# Altium project WR_Cute_Carrier.PrjPcb (part 1 of 2)
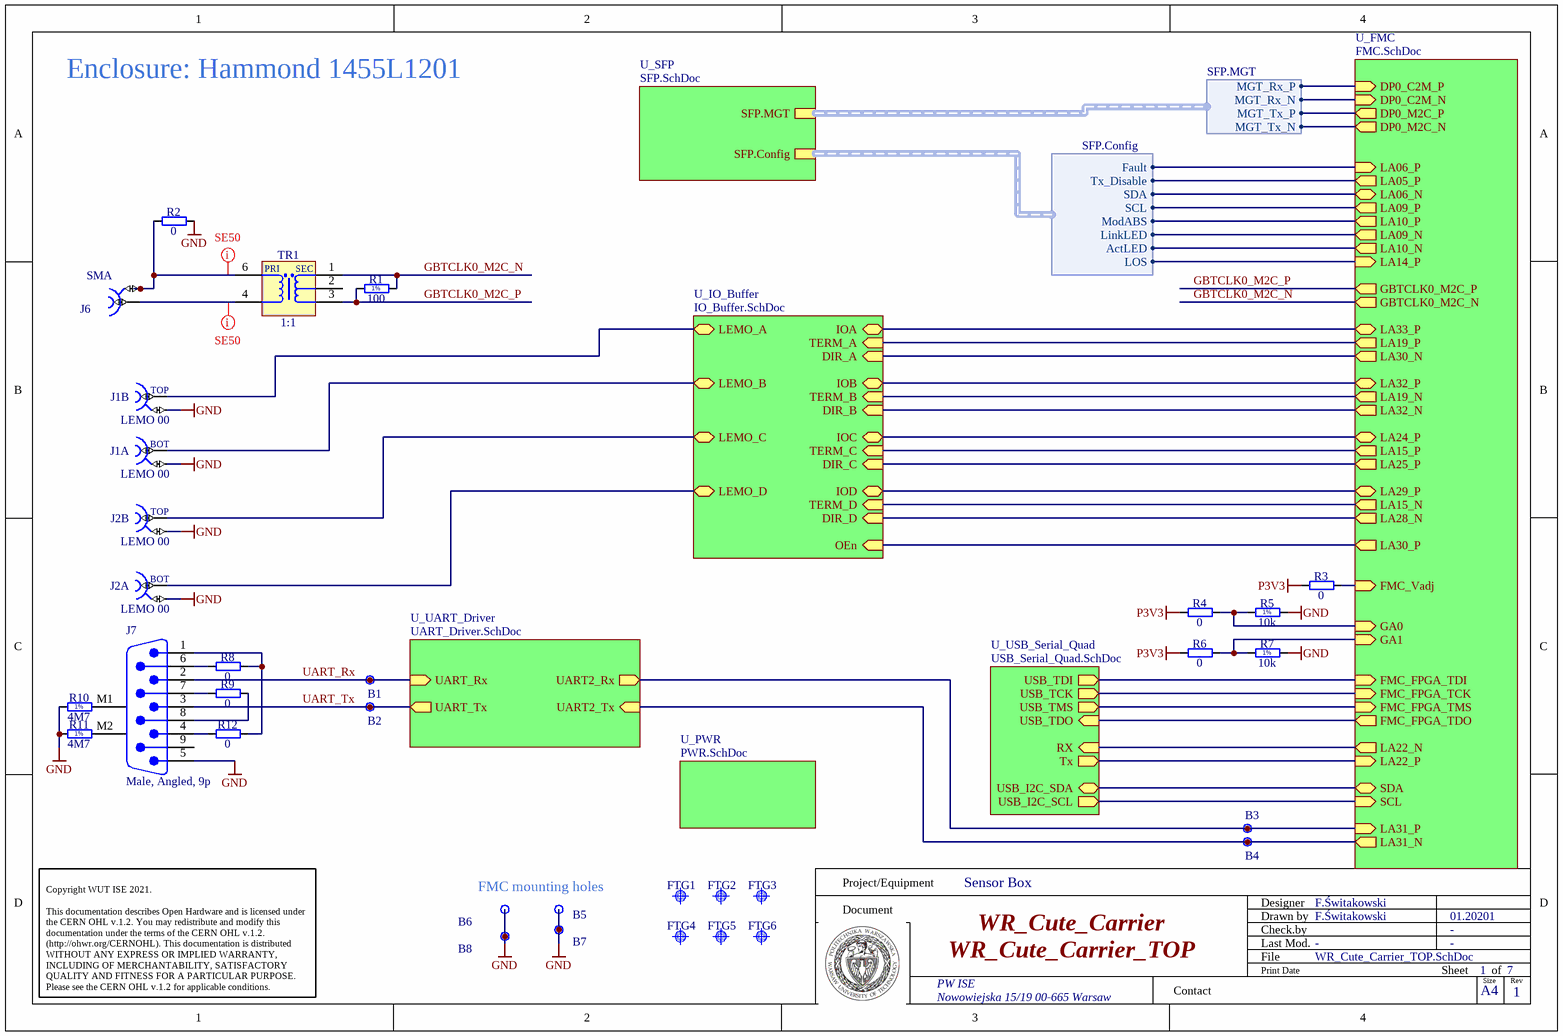
[diagram p0: WR_Cute_Carrier_TOP.SchDoc]
7 sheets, 221 parts. Net scope: hierarchical (ports join the sheet entries above them; power ports are global).
Board files: WR_Cute_Carrier.PcbDoc, panel_front.PcbDoc, panel_rear.PcbDoc
Sheets:
  WR_Cute_Carrier_TOP.SchDoc
    U_FMC = FMC.SchDoc
    U_PWR = PWR.SchDoc
    U_SFP = SFP.SchDoc
    U_USB_Serial_Quad = USB_Serial_Quad.SchDoc
    U_IO_Buffer = IO_Buffer.SchDoc
    U_UART_Driver = UART_Driver.SchDoc

## Sheet WR_Cute_Carrier_TOP.SchDoc: WR_Cute_Carrier
size A4; Author: G.Kasprowicz; CompanyName: WUT ISE; DrawnBy: G.Kasprowicz; Organization: WUT ISE; Address1: PW ISE; Address2: Nowowiejska 15/19 00-665 Warsaw; Address3: gkasprow@gmail.com; DocumentNumber: 1; Revision: 2; SheetNumber: 1; SheetTotal: 7; ModifiedBy: -; CheckedDate: -; Title2: WR_Cute_Carrier_TOP; DivGrp: WUT ISE; Designer: G.Kasprowicz; ModifiedDate: -; ProjectName: Sensor Box

### Parts
B1  Plated Hole  [c130h60]  (value not drawn)  (no BOM)
B2  Plated Hole  [c130h60]  (value not drawn)  (no BOM)
B3  Plated Hole  [c130h60]  (value not drawn)  (no BOM)
B4  Plated Hole  [c130h60]  (value not drawn)  (no BOM)
B5  Plated Hole  [MTG270_500]  (value not drawn)  (no BOM)
B6  Plated Hole  [MTG270_500]  (value not drawn)  (no BOM)
B7  Plated Hole  [MTG270_500]  (value not drawn)  (no BOM)
B8  Plated Hole  [MTG270_500]  (value not drawn)  (no BOM)
FTG1  Use only in PCB  [FIDUCIAL_TOP_S100-200]  (value not drawn)  (no BOM)
FTG2  Use only in PCB  [FIDUCIAL_TOP_S100-200]  (value not drawn)  (no BOM)
FTG3  Use only in PCB  [FIDUCIAL_TOP_S100-200]  (value not drawn)  (no BOM)
FTG4  Use only in PCB  [FIDUCIAL_TOP_S100-200]  (value not drawn)  (no BOM)
FTG5  Use only in PCB  [FIDUCIAL_TOP_S100-200]  (value not drawn)  (no BOM)
FTG6  Use only in PCB  [FIDUCIAL_TOP_S100-200]  (value not drawn)  (no BOM)
J1  LEMO 00  [LEMO_EPY.00.250.NTN]  (parts A,B of 2)
J2  LEMO 00  [LEMO_EPY.00.250.NTN]  (parts A,B of 2)
J6  SMA  [AMPHENOL_132203]
J7  Male, Angled, 9p  [210112013]
R1  100  [RESC2012X60N]
R2  0  [RESC1608X55N]
R3  0  [RESC1608X55N]
R4  0  [RESC1608X55N]
R5  10k  [RESC1608X55N]
R6  0  [RESC1608X55N]
R7  10k  [RESC1608X55N]
R8  0  [RESC1608X55N]
R9  0  [RESC1608X55N]
R10  4M7  [RESC2113X55N]
R11  4M7  [RESC2113X55N]
R12  0  [RESC1608X55N]
TR1  1:1  [XFMR_MINI-CIRCUITS_AT1521]

### Sub-sheets
U_FMC = FMC.SchDoc: DP0_C2M_P (in), DP0_C2M_N (in), DP0_M2C_P (out), DP0_M2C_N (out), GA1 (in), GA0 (in), SCL (in), SDA (bidir), FMC_Vadj (in), GBTCLK0_M2C_P (out), GBTCLK0_M2C_N (out), FMC_FPGA_TMS (in), FMC_FPGA_TCK (in), FMC_FPGA_TDO (out), FMC_FPGA_TDI (in), LA33_P (bidir), LA19_P (out), LA32_P (bidir), LA19_N (out), LA22_P (in), LA22_N (out), LA31_P (in), LA31_N (out), LA06_P (in), LA05_P (out), LA06_N (bidir), LA09_P (out), LA10_P (out), LA09_N (out), LA10_N (out), LA14_P (in), LA24_P (bidir), LA15_P (out), LA25_P (out), LA29_P (bidir), LA30_N (out), LA32_N (out), LA28_N (out), LA15_N (out), LA30_P (out)
U_IO_Buffer = IO_Buffer.SchDoc: IOA (bidir), TERM_A (in), IOB (bidir), TERM_B (in), LEMO_A (bidir), LEMO_B (bidir), LEMO_C (bidir), LEMO_D (bidir), IOC (bidir), TERM_C (in), IOD (bidir), TERM_D (in), DIR_A (in), DIR_D (in), OEn (in), DIR_B (in), DIR_C (in)
U_PWR = PWR.SchDoc: no entries
U_SFP = SFP.SchDoc: SFP.MGT (harness SFP.MGT), SFP.Config (harness SFP.Config)
U_UART_Driver = UART_Driver.SchDoc: UART_Rx (in), UART_Tx (out), UART2_Rx (out), UART2_Tx (in)
U_USB_Serial_Quad = USB_Serial_Quad.SchDoc: USB_TDI (out), USB_TCK (out), USB_TMS (out), USB_TDO (in), RX (in), Tx (out), USB_I2C_SDA (bidir), USB_I2C_SCL (out)

### Harnesses
SFP.Config: Fault, Tx_Disable, SDA, SCL, ModABS, LOS, LinkLED, ActLED
SFP.MGT: MGT_Rx_N, MGT_Rx_P, MGT_Tx_N, MGT_Tx_P

### Nets
GND: B5.1 B6.1 B7.1 B8.1 J1.3 J2.3 J7.5 R2.2 R5.2 R7.2 R10.1 R11.1
P3V3: R3.1 R4.1 R6.1
DIR_A: sheet U_FMC/LA30_N, sheet U_IO_Buffer/DIR_A
DIR_B: sheet U_FMC/LA32_N, sheet U_IO_Buffer/DIR_B
DIR_C: sheet U_FMC/LA25_P, sheet U_IO_Buffer/DIR_C
DIR_D: sheet U_FMC/LA28_N, sheet U_IO_Buffer/DIR_D
DP0_C2M_N: sheet U_FMC/DP0_C2M_N, sheet U_SFP/SFP.MGT.MGT_Rx_N
DP0_C2M_P: sheet U_FMC/DP0_C2M_P, sheet U_SFP/SFP.MGT.MGT_Rx_P
DP0_M2C_N: sheet U_FMC/DP0_M2C_N, sheet U_SFP/SFP.MGT.MGT_Tx_N
DP0_M2C_P: sheet U_FMC/DP0_M2C_P, sheet U_SFP/SFP.MGT.MGT_Tx_P
FMC_VADJ: R3.2 ; sheet U_FMC/FMC_Vadj
GA0: R4.2 R5.1 ; sheet U_FMC/GA0
GA1: R6.2 R7.1 ; sheet U_FMC/GA1
GBTCLK0_M2C_N: R1.2 TR1.1(SDOT) ; sheet U_FMC/GBTCLK0_M2C_N
GBTCLK0_M2C_P: R1.1 TR1.3(S) ; sheet U_FMC/GBTCLK0_M2C_P
IOA: sheet U_FMC/LA33_P, sheet U_IO_Buffer/IOA
IOB: sheet U_FMC/LA32_P, sheet U_IO_Buffer/IOB
IOC: sheet U_FMC/LA24_P, sheet U_IO_Buffer/IOC
IOD: sheet U_FMC/LA29_P, sheet U_IO_Buffer/IOD
LA05_P: sheet U_FMC/LA05_P, sheet U_SFP/SFP.Config.Tx_Disable
LA06_N: sheet U_FMC/LA06_N, sheet U_SFP/SFP.Config.SDA
LA06_P: sheet U_FMC/LA06_P, sheet U_SFP/SFP.Config.Fault
LA09_N: sheet U_FMC/LA09_N, sheet U_SFP/SFP.Config.LinkLED
LA09_P: sheet U_FMC/LA09_P, sheet U_SFP/SFP.Config.SCL
LA10_N: sheet U_FMC/LA10_N, sheet U_SFP/SFP.Config.ActLED
LA10_P: sheet U_FMC/LA10_P, sheet U_SFP/SFP.Config.ModABS
LA14_P: sheet U_FMC/LA14_P, sheet U_SFP/SFP.Config.LOS
LA15_N: sheet U_FMC/LA15_N, sheet U_IO_Buffer/TERM_D
LA15_P: sheet U_FMC/LA15_P, sheet U_IO_Buffer/TERM_C
LA19_N: sheet U_FMC/LA19_N, sheet U_IO_Buffer/TERM_B
LA19_P: sheet U_FMC/LA19_P, sheet U_IO_Buffer/TERM_A
LA22_N: sheet U_FMC/LA22_N, sheet U_USB_Serial_Quad/RX
LA22_P: sheet U_FMC/LA22_P, sheet U_USB_Serial_Quad/Tx
LA30_P: sheet U_FMC/LA30_P, sheet U_IO_Buffer/OEn
LA31_N: B4.1 ; sheet U_FMC/LA31_N, sheet U_UART_Driver/UART2_Tx
LA31_P: B3.1 ; sheet U_FMC/LA31_P, sheet U_UART_Driver/UART2_Rx
LEMO_A: J1.2 ; sheet U_IO_Buffer/LEMO_A
LEMO_B: J1.1 ; sheet U_IO_Buffer/LEMO_B
LEMO_C: J2.2 ; sheet U_IO_Buffer/LEMO_C
LEMO_D: J2.1 ; sheet U_IO_Buffer/LEMO_D
SCL: sheet U_FMC/SCL, sheet U_USB_Serial_Quad/USB_I2C_SCL
SDA: sheet U_FMC/SDA, sheet U_USB_Serial_Quad/USB_I2C_SDA
UART_Rx: B1.1 J7.2 ; sheet U_UART_Driver/UART_Rx
UART_Tx: B2.1 J7.3 ; sheet U_UART_Driver/UART_Tx
NetIC17_4: sheet U_FMC/FMC_FPGA_TCK, sheet U_USB_Serial_Quad/USB_TCK
NetIC17_5: sheet U_FMC/FMC_FPGA_TDI, sheet U_USB_Serial_Quad/USB_TDI
NetIC19_4: sheet U_FMC/FMC_FPGA_TDO, sheet U_USB_Serial_Quad/USB_TDO
NetIC19_5: sheet U_FMC/FMC_FPGA_TMS, sheet U_USB_Serial_Quad/USB_TMS
NetJ6_1: J6.1 TR1.4(P)
NetJ6_2: J6.2 R2.1 TR1.6(PDOT)
NetJ7_1: J7.1 R8.2 R12.2
NetJ7_4: J7.4 R12.1
NetJ7_6: J7.6 R8.1
NetJ7_7: J7.7 R9.1
NetJ7_8: J7.8 R9.2
NetJ7_M1: J7.M1 R10.2
NetJ7_M2: J7.M2 R11.2

Not connected (* = marked no-connect by the designer): J7 9; TR1 2(NC)

### Layout directives
net class SE50: NetJ6_1, NetJ6_2

### Notes on the sheet
- Enclosure: Hammond 1455L1201
- FMC mounting holes
- Project/Equipment
- Document
- Designer
- Drawn by
- Check.by
- F.Świtakowski
- 01.20201
- PW ISE
- Contact
- File
- Last Mod.
- Print Date
- Sheet
- Size
- A4
- of
- 1
- Rev
- Copyright WUT ISE 2021.
  This documentation describes Open Hardware and is licensed under the CERN OHL v.1.2. You may redistribute and modify this documentation under the terms of the CERN OHL v.1.2. (http://ohwr.org/CERNOHL). This documentation is distributed WITHOUT ANY EXPRESS OR IMPLIED WARRANTY, INCLUDING OF MERCHANTABILITY, SATISFACTORY QUALITY AND FITNESS FOR A PARTICULAR PURPOSE. Please see the CERN OHL v.1.2 for applicable conditions.
- Nowowiejska 15/19 00-665 Warsaw
- (in symbol LEMO_EPY.00.250.NTN, part A) BOT
- (in symbol LEMO_EPY.00.250.NTN, part B) TOP
- (in symbol R0603_10K_1%_0.1W_100PPM) 1%
- (in symbol R0805_4M7_1%_0.125W_100PPM_VISHAY_CRCW e3) 1%
- (in symbol R0805_100R_1%_0.125W_100PPM) 1%
- (in symbol XFMR_MINI-CIRCUITS_TC2-1TX+) PRI; SEC

### Library data of the parts
B1-B4 = PLATED_HOLE0.6_PAD1.3: Single Terminal Socket; Part Description: Plated Through Hole: Hole Dia.=0.6mm Pad Dia.=1.3mm; Mounted: No; Part Number: PLATED_HOLE0.6_PAD1.3; Component Type: Standard (No BOM); Pin Count: 1; Family: Plated Hole; Socket: No; SMD: No; Sense: No; Status: None; ComponentHeight: 0mm; HelpURL: Undefined; Author: CERN DEM MR; CreateDate: 02.03.2016; LatestRevisionDate: 02.03.2016; PackageDescription: Plated Through Hole: Hole Dia.=0.6mm Pad Dia.=1.3mm
B5-B8 = PLATED_HOLE2.7_PAD5.0: Single Terminal Socket; Part Description: Plated Through Hole: Hole Dia.=2.7mm Pad Dia.=5.0mm; Mounted: No; Table: Pads; Part Number: PLATED_HOLE2.7_PAD5.0; Component Type: Standard (No BOM); Pin Count: 1; Family: Plated Hole; Socket: No; SMD: No; Status: None; ComponentHeight: 0mm; Author: CERN DEM JMW; CreateDate: 2011-09-27; LatestRevisionDate: 2011-09-27; PackageDescription: Plated Through Hole: Hole Dia.=2.7mm Pad Dia.=5.0mm
FTG1-FTG6 = FIDUCIAL_TARGET_S100-200: Fiducial Target; Part Description: Square Fiducial Target, Top Layer, 1.0mm, Top Solder 2.0mm, Keepout =2.0mm; Mounted: No; Part Number: FIDUCIAL_TARGET_S100-200; Component Type: Standard (No BOM); Pin Count: 1; Family: Fiducial; Socket: No; SMD: Yes; Sense: No; Status: None; ComponentHeight: 0mm; HelpURL: Undefined; Author: CERN DEM JLC; CreateDate: 09.02.2010; LatestRevisionDate: 04.04.2012; PackageDescription: Square Fiducial Target, Top Layer, 1.0mm, Top Solder 2.0mm, Keepout =2.0mm
J1 J2 = LEMO_EPY.00.250.NTN: Dual Female Coax 1-2 Common Shield 3; Part Description: Size 00, Dual 50 Ohms Coaxial Elbow Sockets (90°); PressFit: No; SCEM: 09.46.11.186.0; Part Number: LEMO_EPY.00.250.NTN; Component Kind: Standard; Component Type: Standard; Pin Count: 4; Family: LEMO 00; Mounted: Yes; Socket: No; SMD: No; Sense: No; Status: None; Manufacturer: LEMO; Manufacturer Part Number: EPY.00.250.NTN; ComponentHeight: 14.8mm; HelpURL: \\cern.ch\dfs\Applications\Altium\Datasheets\LEMO_EPY.00.250.NTN.pdf; Author: CERN DEM JMW; CreateDate: 10.12.2008; LatestRevisionDate: 11.08.2009
J6 = AMPHENOL_132203: Part Description: 50 Ohm Through Hole SMA Right Angle PCB Jack; Manufacturer Part Number: 132203; PressFit: No; Part Number: AMPHENOL_132203; Component Kind: Standard; Component Type: Standard; Pin Count: 5; Family: SMA; Mounted: Yes; Socket: No; SMD: No; Sense: No; Status: None; Manufacturer: AMPHENOL; ComponentHeight: 10.44mm; HelpURL: \\cern.ch\dfs\Applications\Altium\Datasheets\AMPHENOL_132203.pdf; Author: CERN DEM MR; CreateDate: 06.10.2016; LatestRevisionDate: 06.10.2016
J7 = 210112013: WE-D-SUB Filter Connector, THT, Angled, Male, 9p; Manufacturer: Wurth Elektronik; Insulation Resistance min.: 1000MOhm; Pin Number: 9; Rated Voltage: 100VDC; Rated Current: 5A; Withstand Voltage: 250Vrms; ComponentLink1Description: Manufacturer; ComponentLink1URL: http://www.we-online.de; ComponentLink2Description: Datasheet; Gender: Male; ComponentLink2URL: https://www.we-online.com/catalog/datasheet/210112013.pdf; Mounting Technology: THT; Packaging: Tray; Orientation: Angled; Operating Temperature: -55 to +125degC; Manufacturer Part Number: 210112013; Published Date: April 2020
R1 = R0805_100R_1%_0.125W_100PPM: Resistor - 1%; Part Description: General Purpose Thick Film Chip Resistor; Manufacturer: GENERIC; Manufacturer1 Part Number: NRC10F4700TRF; Power: 0.125W; TC: ±100ppm/°C; PressFit: No; Part Number: R0805_100R_1%_0.125W_100PPM; Component Kind: Standard; Component Type: Standard; Pin Count: 2; Value: 100; Status: Preferred; Tolerance: ±1%; Manufacturer Part Number: R0805_100R_1%_0.125W_100PPM; Case: 0805; Mounted: Yes; Sense: No; Socket: No; SMD: Yes; Manufacturer1 Example: NIC COMPONENT; Manufacturer1 ComponentHeight: 0.6mm; HelpURL: \\cern.ch\dfs\Applications\Altium\Datasheets\R0805_NIC_NRC.pdf; Author: CERN DEM JLC; CreateDate: 03.12.2007; LatestRevisionDate: 13.03.2008
R2-R4 R6 R8 R9 R12 = R0603_0R_JUMPER: Resistor; Part Description: 1A (0.05R Max DC Resistance) Zero Ohm Jumper; Manufacturer: GENERIC; Manufacturer1 Part Number: NRC06Z0; PressFit: No; Part Number: R0603_0R_JUMPER; Component Kind: Standard; Component Type: Standard; Pin Count: 2; Value: 0; Status: Preferred; Manufacturer Part Number: R0603_0R_JUMPER; Case: 0603; Mounted: Yes; Sense: No; Socket: No; SMD: Yes; Manufacturer1 Example: NIC COMPONENT; Manufacturer1 ComponentHeight: 0.55mm; HelpURL: \\cern.ch\dfs\Applications\Altium\Datasheets\R0603_NIC_NRC.pdf; Author: CERN DEM JLC; CreateDate: 03.12.2007; LatestRevisionDate: 13.03.2008
R5 R7 = R0603_10K_1%_0.1W_100PPM: Resistor - 1%; Part Description: General Purpose Thick Film Chip Resistor; Manufacturer: GENERIC; Manufacturer1 Part Number: NRC06F1002TRF; Power: 0.1W; TC: ±100ppm/°C; PressFit: No; Part Number: R0603_10K_1%_0.1W_100PPM; Component Kind: Standard; Component Type: Standard; Pin Count: 2; Value: 10k; Status: Preferred; Tolerance: ±1%; Manufacturer Part Number: R0603_10K_1%_0.1W_100PPM; Case: 0603; Mounted: Yes; Sense: No; Socket: No; SMD: Yes; Manufacturer1 Example: NIC COMPONENT; Manufacturer1 ComponentHeight: 0.55mm; HelpURL: \\cern.ch\dfs\Applications\Altium\Datasheets\R0603_NIC_NRC.pdf; Author: CERN DEM JLC; CreateDate: 03.12.2007; LatestRevisionDate: 13.03.2008
R10 R11 = R0805_4M7_1%_0.125W_100PPM_VISHAY_CRCW e3: Resistor - 1%; Part Description: 150V, Standard Thick Film Chip Resistor; Manufacturer: VISHAY; Manufacturer Part Number: CRCW08054M70FKEA; Power: 0.125W; TC: ±100ppm/°C; PressFit: No; Part Number: R0805_4M7_1%_0.125W_100PPM_VISHAY_CRCW e3; Component Kind: Standard; Component Type: Standard; Pin Count: 2; Value: 4M7; Status: None; Tolerance: ±1%; Case: 0805; Mounted: Yes; Sense: No; Socket: No; SMD: Yes; ComponentHeight: 0.5mm; HelpURL: \\cern.ch\dfs\Applications\Altium\Datasheets\R0805_VISHAY_CRCW e3.pdf; Author: CERN DEM BR; CreateDate: 27.05.2019; LatestRevisionDate: 27.05.2019
TR1 = XFMR_MINI-CIRCUITS_TC2-1TX+: 50 Ohms 3 to 300MHz RF Transformer; Part Number: XFMR_MINI-CIRCUITS_TC2-1TX+; Component Kind: Standard; Component Type: Standard; Pin Count: 5; Value: 1:1; Status: None; Part Description: 50 Ohms 3 to 300MHz RF Transformer; Manufacturer: MINI-CIRCUITS; Manufacturer Part Number: TC2-1TX+; Mounted: Yes; Socket: No; Sense: No; SMD: Yes; ComponentHeight: 4.06mm; HelpURL: \\cern.ch\dfs\Applications\Altium\Datasheets\XFMR_MINI-CIRCUITS_TC2-1TX+.pdf; Author: CERN DEM MR; CreateDate: 18.10.2019; LatestRevisionDate: 18.10.2019

## Sheet FMC.SchDoc: WR_Cute_Carrier
size A4; Author: G.Kasprowicz; CompanyName: WUT ISE; DrawnBy: G.Kasprowicz; Organization: WUT ISE; Address1: PW ISE; Address2: Nowowiejska 15/19 00-665 Warsaw; Address3: gkasprow@gmail.com; DocumentNumber: 2; Revision: 2; SheetNumber: 2; SheetTotal: 7; ModifiedBy: -; CheckedDate: -; Title2: FMC; DivGrp: WUT ISE; Designer: G.Kasprowicz; ModifiedDate: -; ProjectName: Sensor Box
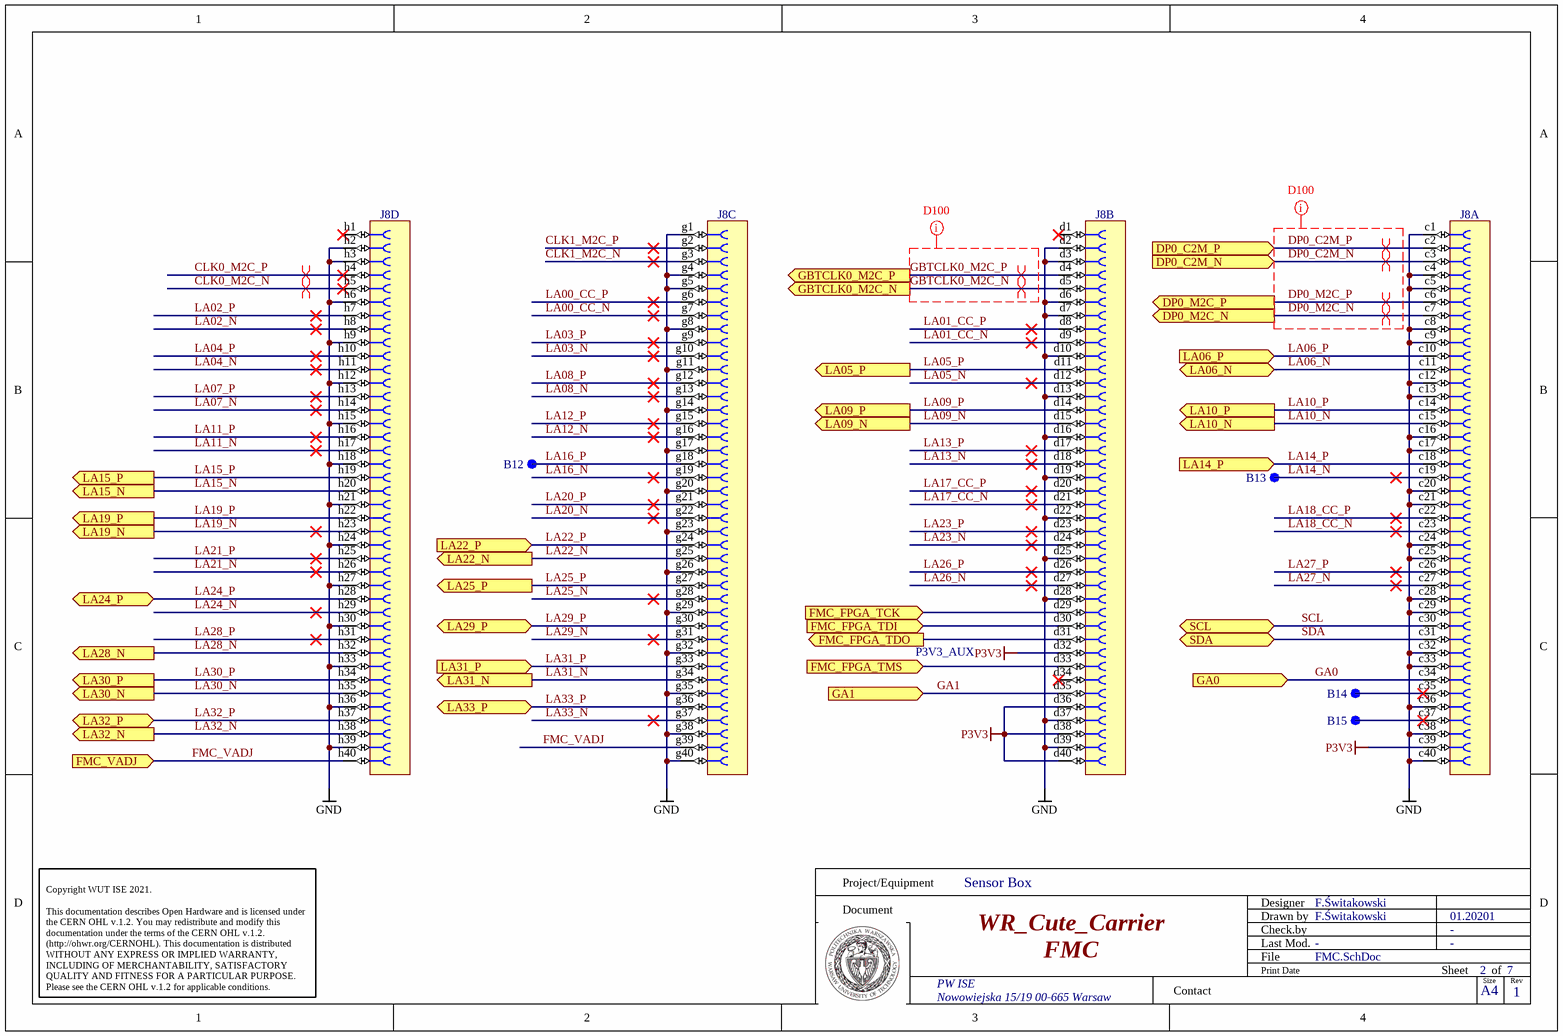
[diagram p1: FMC.SchDoc]

### Parts
B12  SMD Pad  [C100]  (value not drawn)  (no BOM)
B13  SMD Pad  [C100]  (value not drawn)  (no BOM)
B14  SMD Pad  [C100]  (value not drawn)  (no BOM)
B15  SMD Pad  [C100]  (value not drawn)  (no BOM)
J8  VITA 57  [SAMTEC_ASP-134603-01]  (value not drawn)  (parts A,B,C,D of 4)

### Ports
DP0_C2M_N (in), DP0_C2M_P (in), DP0_M2C_N (out), DP0_M2C_P (out), FMC_FPGA_TCK (in), FMC_FPGA_TDI (in), FMC_FPGA_TDO (out), FMC_FPGA_TMS (in), FMC_VADJ (in), GA0 (in), GA1 (in), GBTCLK0_M2C_N (out), GBTCLK0_M2C_P (out), LA05_P (out), LA06_N (bidir), LA06_P (in), LA09_N (out), LA09_P (out), LA10_N (out), LA10_P (out), LA14_P (in), LA15_N (out), LA15_P (out), LA19_N (out), LA19_P (out), LA22_N (out), LA22_P (in), LA24_P (bidir), LA25_P (out), LA28_N (out), LA29_P (bidir), LA30_N (out), LA30_P (out), LA31_N (out), LA31_P (in), LA32_N (out), LA32_P (bidir), LA33_P (bidir), SCL (bidir), SDA (bidir)

### Nets
GND: J8.c1 J8.c4 J8.c5 J8.c8 J8.c9 J8.c12 J8.c13 J8.c16 J8.c17 J8.c20 J8.c21 J8.c24 J8.c25 J8.c28 J8.c29 J8.c32 J8.c33 J8.c36 J8.c38 J8.c40 J8.d2 J8.d3 J8.d6 J8.d7 J8.d10 J8.d13 J8.d16 J8.d19 J8.d22 J8.d25 J8.d28 J8.d37 J8.d39 J8.g1 J8.g4 J8.g5 J8.g8 J8.g11 J8.g14 J8.g17 J8.g20 J8.g23 J8.g26 J8.g29 J8.g32 J8.g35 J8.g38 J8.g40 J8.h2 J8.h3 J8.h6 J8.h9 J8.h12 J8.h15 J8.h18 J8.h21 J8.h24 J8.h27 J8.h30 J8.h33 J8.h36 J8.h39
P3V3: J8.c39 J8.d32 J8.d36 J8.d38 J8.d40
CLK0_M2C_N: J8.h5
CLK0_M2C_P: J8.h4
CLK1_M2C_N: J8.g3
CLK1_M2C_P: J8.g2
DP0_C2M_N: J8.c3 ; port DP0_C2M_N
DP0_C2M_P: J8.c2 ; port DP0_C2M_P
DP0_M2C_N: J8.c7 ; port DP0_M2C_N
DP0_M2C_P: J8.c6 ; port DP0_M2C_P
FMC_VADJ: J8.g39 J8.h40 ; port FMC_VADJ
GA0: J8.c34 ; port GA0
GA1: J8.d35 ; port GA1
GBTCLK0_M2C_N: J8.d5 ; port GBTCLK0_M2C_N
GBTCLK0_M2C_P: J8.d4 ; port GBTCLK0_M2C_P
LA00_CC_N: J8.g7
LA00_CC_P: J8.g6
LA01_CC_N: J8.d9
LA01_CC_P: J8.d8
LA02_N: J8.h8
LA02_P: J8.h7
LA03_N: J8.g10
LA03_P: J8.g9
LA04_N: J8.h11
LA04_P: J8.h10
LA05_N: J8.d12
LA05_P: J8.d11 ; port LA05_P
LA06_N: J8.c11 ; port LA06_N
LA06_P: J8.c10 ; port LA06_P
LA07_N: J8.h14
LA07_P: J8.h13
LA08_N: J8.g13
LA08_P: J8.g12
LA09_N: J8.d15 ; port LA09_N
LA09_P: J8.d14 ; port LA09_P
LA10_N: J8.c15 ; port LA10_N
LA10_P: J8.c14 ; port LA10_P
LA11_N: J8.h17
LA11_P: J8.h16
LA12_N: J8.g16
LA12_P: J8.g15
LA13_N: J8.d18
LA13_P: J8.d17
LA14_N: B13.1 J8.c19
LA14_P: J8.c18 ; port LA14_P
LA15_N: J8.h20 ; port LA15_N
LA15_P: J8.h19 ; port LA15_P
LA16_N: J8.g19
LA16_P: B12.1 J8.g18
LA17_CC_N: J8.d21
LA17_CC_P: J8.d20
LA18_CC_N: J8.c23
LA18_CC_P: J8.c22
LA19_N: J8.h23 ; port LA19_N
LA19_P: J8.h22 ; port LA19_P
LA20_N: J8.g22
LA20_P: J8.g21
LA21_N: J8.h26
LA21_P: J8.h25
LA22_N: J8.g25 ; port LA22_N
LA22_P: J8.g24 ; port LA22_P
LA23_N: J8.d24
LA23_P: J8.d23
LA24_N: J8.h29
LA24_P: J8.h28 ; port LA24_P  [project net IOC]
LA25_N: J8.g28
LA25_P: J8.g27 ; port LA25_P  [project net DIR_C]
LA26_N: J8.d27
LA26_P: J8.d26
LA27_N: J8.c27
LA27_P: J8.c26
LA28_N: J8.h32 ; port LA28_N  [project net DIR_D]
LA28_P: J8.h31
LA29_N: J8.g31
LA29_P: J8.g30 ; port LA29_P  [project net IOD]
LA30_N: J8.h35 ; port LA30_N  [project net DIR_A]
LA30_P: J8.h34 ; port LA30_P
LA31_N: J8.g34 ; port LA31_N
LA31_P: J8.g33 ; port LA31_P
LA32_N: J8.h38 ; port LA32_N  [project net DIR_B]
LA32_P: J8.h37 ; port LA32_P  [project net IOB]
LA33_N: J8.g37
LA33_P: J8.g36 ; port LA33_P  [project net IOA]
SCL: J8.c30 ; port SCL
SDA: J8.c31 ; port SDA
NetB14_1: B14.1 J8.c35
NetB15_1: B15.1 J8.c37
NetIC17_4: J8.d29 ; port FMC_FPGA_TCK
NetIC17_5: J8.d30 ; port FMC_FPGA_TDI
NetIC19_4: J8.d31 ; port FMC_FPGA_TDO
NetIC19_5: J8.d33 ; port FMC_FPGA_TMS

Not connected (* = marked no-connect by the designer): J8 d1* d34* h1*

### Layout directives
differential pair: CLK0_M2C_N, CLK0_M2C_P, DP0_C2M_N, DP0_C2M_P, DP0_M2C_N, DP0_M2C_P, GBTCLK0_M2C_N, GBTCLK0_M2C_P
net class D100: DP0_C2M_N, DP0_C2M_P, DP0_M2C_N, DP0_M2C_P, GBTCLK0_M2C_N, GBTCLK0_M2C_P

### Notes on the sheet
- P3V3_AUX
- Project/Equipment
- Document
- Designer
- Drawn by
- Check.by
- F.Świtakowski
- 01.20201
- PW ISE
- Contact
- File
- Last Mod.
- Print Date
- Sheet
- Size
- A4
- of
- 1
- Rev
- Copyright WUT ISE 2021.
  This documentation describes Open Hardware and is licensed under the CERN OHL v.1.2. You may redistribute and modify this documentation under the terms of the CERN OHL v.1.2. (http://ohwr.org/CERNOHL). This documentation is distributed WITHOUT ANY EXPRESS OR IMPLIED WARRANTY, INCLUDING OF MERCHANTABILITY, SATISFACTORY QUALITY AND FITNESS FOR A PARTICULAR PURPOSE. Please see the CERN OHL v.1.2 for applicable conditions.
- Nowowiejska 15/19 00-665 Warsaw

### Library data of the parts
B12-B15 = SMD_PAD_D1MM: Through Hole Pad; Part Description: 1mm Diameter SMD Pad; Mounted: No; Part Number: SMD_PAD_D1MM; Component Type: Standard (No BOM); Pin Count: 1; Family: SMD Pad; Socket: No; SMD: No; Sense: No; Status: None; ComponentHeight: 0mm; HelpURL: Undefined; Author: CERN DEM JLC; CreateDate: 10.10.2017; LatestRevisionDate: 10.10.2017; PackageDescription: 1mm Diameter SMD Pad
J8 = SAMTEC_ASP-134603-01: Connector VITA 57, 160 Female contacts in 4 row cdgh; Part Description: 160 contacts (4 rows cdgh) Surface Mount Female Connector, VITA 57 (CC-LPC-10); Manufacturer: SAMTEC; PressFit: No; Part Number: SAMTEC_ASP-134603-01; Component Kind: Standard; Component Type: Standard; Pin Count: 160; Family: VITA 57; Mounted: Yes; Socket: No; SMD: Yes; Sense: No; Status: None; Manufacturer Part Number: ASP-134603-01; ComponentHeight: 6.55mm; HelpURL: \\cern.ch\dfs\Applications\Altium\Datasheets\SAMTEC_ASP-134603-01.pdf; Author: CERN DEM JLC; CreateDate: 13.07.2010; LatestRevisionDate: 13.07.2010

## Sheet PWR.SchDoc: WR_Cute_Carrier
size A4; Author: G.Kasprowicz; CompanyName: WUT ISE; DrawnBy: G.Kasprowicz; Organization: WUT ISE; Address1: PW ISE; Address2: Nowowiejska 15/19 00-665 Warsaw; Address3: gkasprow@gmail.com; DocumentNumber: 3; Revision: 2; SheetNumber: 3; SheetTotal: 7; ModifiedBy: -; CheckedDate: -; Title2: PWR; DivGrp: WUT ISE; Designer: G.Kasprowicz; ModifiedDate: -; ProjectName: Sensor Box
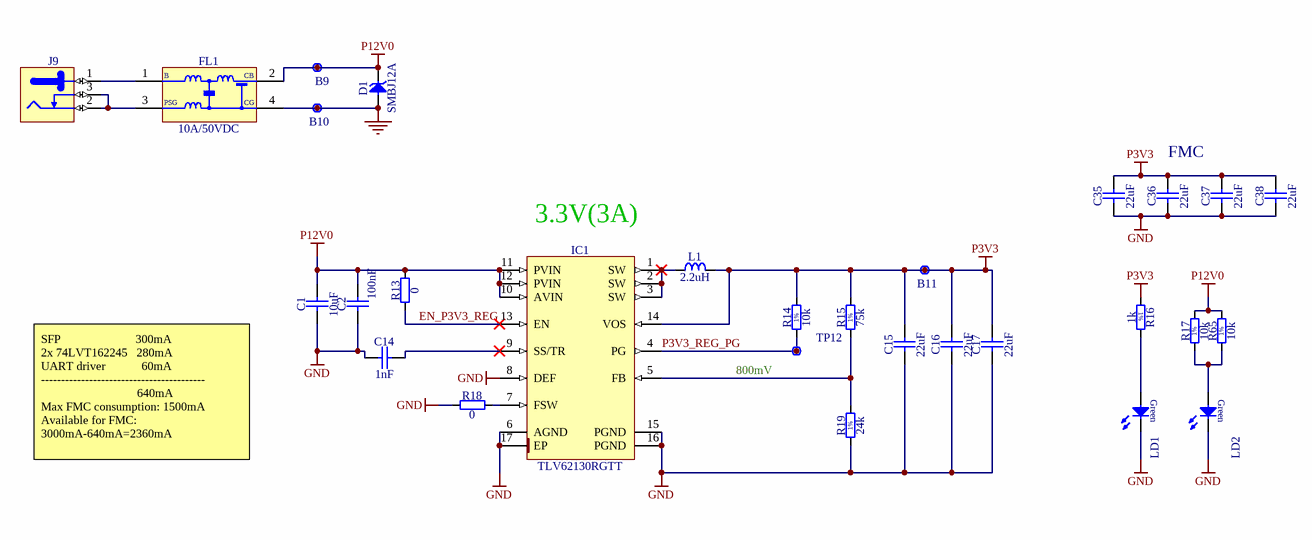
[diagram p2: PWR.SchDoc]

### Parts
B9  Plated Hole  [c130h60]  (value not drawn)  (no BOM)
B10  Plated Hole  [c130h60]  (value not drawn)  (no BOM)
B11  Plated Hole  [c130h60]  (value not drawn)  (no BOM)
C1  10uF  [CAPC2012X95N]
C2  100nF  [CAPC1005X55N]
C14  1nF  [CAPC1005X55N]
C15  22uF  [CAPC2012X135N]
C16  22uF  [CAPC2012X135N]
C17  22uF  [CAPC2012X135N]
C35  22uF  [CAPC2012X135N]
C36  22uF  [CAPC2012X135N]
C37  22uF  [CAPC2012X135N]
C38  22uF  [CAPC2012X135N]
D1  SMBJ12A  [DIOM5336X265N]
FL1  10A/50VDC  [FIL_MURATA_BNX02]
IC1  TLV62130RGTT  [QFN50P300X300X100-17N-S180]
J9  Jack  [SWITCHCRAFT_712RA]  (value not drawn)
L1  2.2uH  [IND_BOURNS_SRP6540]
LD1  Green  [LED_AVAGO_HSME-C120]  (value not drawn)
LD2  Green  [LED_AVAGO_HSME-C120]  (value not drawn)
R13  0  [RESC1608X55N]
R14  10k  [RESC1005X40N]
R15  75k  [RESC2012X60N]
R16  1k  [RESC1005X40N]
R17  10k  [RESC1005X40N]
R18  0  [RESC1608X55N]
R19  24k  [RESC1608X55N]
R65  10k  [RESC1005X40N]
TP12  Q2  [TPS127]  (value not drawn)  (no BOM)

### Nets
GND: B10.1 C1.1 C2.1 C14.1 C15.1 C16.1 C17.1 C35.1 C36.1 C37.1 C38.1 D1.2(A) FL1.4(CG) IC1.6(AGND) IC1.8(DEF) IC1.15(PGND) IC1.16(PGND) IC1.17(EP) LD1.1(C) LD2.1(C) R18.1 R19.1
P3V3: B11.1 C15.2 C16.2 C17.2 C35.2 C36.2 C37.2 C38.2 IC1.14(VOS) L1.2 R14.2 R15.2 R16.1
P12V0: B9.1 C1.2 C2.2 D1.1(C) FL1.2(CB) IC1.10(AVIN) IC1.11(PVIN) IC1.12(PVIN) R13.2 R17.2 R65.2
EN_P3V3_REG: IC1.13(EN) R13.1
P3V3_REG_PG: IC1.4(PG) R14.1 TP12.1
NetC14_2: C14.2 IC1.9(SS/TR)
NetFL1_1: FL1.1(B) J9.1
NetFL1_3: FL1.3(PSG) J9.2 J9.3
NetIC1_1: IC1.1(SW) IC1.2(SW) IC1.3(SW) L1.1
NetIC1_5: IC1.5(FB) R15.1 R19.2
NetIC1_7: IC1.7(FSW) R18.2
NetLD1_2: LD1.2(A) R16.2
NetLD2_2: LD2.2(A) R17.1 R65.1

### Notes on the sheet
- FMC
- 3.3V(3A)
- 800mV
- SFP                         300mA
  2x 74LVT162245   280mA
  UART driver            60mA
  -----------------------------------------
  640mA
  Max FMC consumption: 1500mA
  Available for FMC: 3000mA-640mA=2360mA
- Project/Equipment
- Document
- Designer
- Drawn by
- Check.by
- F.Świtakowski
- 01.20201
- PW ISE
- Contact
- File
- Last Mod.
- Print Date
- Sheet
- Size
- A4
- of
- 1
- Rev
- Copyright WUT ISE 2021.
  This documentation describes Open Hardware and is licensed under the CERN OHL v.1.2. You may redistribute and modify this documentation under the terms of the CERN OHL v.1.2. (http://ohwr.org/CERNOHL). This documentation is distributed WITHOUT ANY EXPRESS OR IMPLIED WARRANTY, INCLUDING OF MERCHANTABILITY, SATISFACTORY QUALITY AND FITNESS FOR A PARTICULAR PURPOSE. Please see the CERN OHL v.1.2 for applicable conditions.
- Nowowiejska 15/19 00-665 Warsaw
- (in symbol R0402_1K_1%_0.0625W_100PPM) 1%
- (in symbol R0402_10K_1%_0.0625W_100PPM) 1%
- (in symbol R0603_24K_1%_0.1W_100PPM) 1%
- (in symbol R0805_75K_1%_0.125W_100PPM) 1%

### Library data of the parts
B9-B11 = PLATED_HOLE0.6_PAD1.3: as B1 on sheet WR_Cute_Carrier_TOP; Part Number: PLATED_HOLE0.6_PAD1.3; Component Type: Standard (No BOM); Pin Count: 1; Family: Plated Hole; Socket: No; SMD: No; Sense: No; Status: None; ComponentHeight: 0mm; HelpURL: Undefined; Author: CERN DEM MR; CreateDate: 02.03.2016; LatestRevisionDate: 02.03.2016; PackageDescription: Plated Through Hole: Hole Dia.=0.6mm Pad Dia.=1.3mm
C1 = CC0805_10UF_25V_10%_X5R: Non-polarised capacitor; Part Description: SMD Multilayer Chip Ceramic Capacitor; Manufacturer: GENERIC; Manufacturer1 Part Number: GRM219R61E106KA12D; Voltage: 25V; TC: X5R; Tolerance: ±10%; Part Number: CC0805_10UF_25V_10%_X5R; Component Kind: Standard; Component Type: Standard; Pin Count: 2; Value: 10uF; Status: Preferred; Manufacturer Part Number: CC0805_10UF_25V_10%_X5R; Case: 0805; Mounted: Yes; Socket: No; SMD: Yes; Sense: No; Manufacturer1 Example: MURATA; Manufacturer1 ComponentHeight: 0.95mm; HelpURL: \\cern.ch\dfs\Applications\Altium\Datasheets\CC0805_X5R_MURATA_GRM.pdf; Author: CERN DEM JLC; CreateDate: 25/10/2012; LatestRevisionDate: 06/09/2016
C2 = CC0402_100NF_16V_10%_X7R: Non-polarised capacitor; Part Description: SMD Multilayer Chip Ceramic Capacitor; Manufacturer: GENERIC; Manufacturer1 Part Number: GRM155R71C104KA88D; Voltage: 16V; TC: X7R; Tolerance: ±10%; Part Number: CC0402_100NF_16V_10%_X7R; Component Kind: Standard; Component Type: Standard; Pin Count: 2; Value: 100nF; Status: Not Recommended; Manufacturer Part Number: CC0402_100NF_16V_10%_X7R; Case: 0402; Mounted: Yes; Socket: No; SMD: Yes; Sense: No; Manufacturer1 Example: MURATA; Manufacturer1 ComponentHeight: 0.55mm; HelpURL: \\cern.ch\dfs\Applications\Altium\Datasheets\CC0402_X7R_MURATA_GRM.pdf; Author: CERN DEM JLC; CreateDate: 05/12/2013; LatestRevisionDate: 03/12/2007
C14 = CC0402_1NF_50V_10%_X7R: Non-polarised capacitor; Part Description: SMD Multilayer Chip Ceramic Capacitor; Manufacturer: GENERIC; Manufacturer1 Part Number: 223858715623; Voltage: 50V; TC: X7R; Tolerance: ±10%; Part Number: CC0402_1NF_50V_10%_X7R; Component Kind: Standard; Component Type: Standard; Pin Count: 2; Value: 1nF; Status: Not Recommended; Manufacturer Part Number: CC0402_1NF_50V_10%_X7R; Case: 0402; Mounted: Yes; Socket: No; SMD: Yes; Sense: No; Manufacturer1 Example: PHYCOMP; Manufacturer1 ComponentHeight: 0.55mm; HelpURL: \\cern.ch\dfs\Applications\Altium\Datasheets\CC0402_X7R_PHYCOMP.pdf; Author: CERN DEM JLC; CreateDate: 03/12/2007; LatestRevisionDate: 03/12/2007
C15-C17 C35-C38 = CC0805_22UF_16V_10%_X5R: Non-polarised capacitor; Part Description: SMD Multilayer Chip Ceramic Capacitor; Manufacturer: GENERIC; Manufacturer1 Part Number: C2012X5R1C226KT; Voltage: 16V; TC: X5R; Tolerance: ±10%; Part Number: CC0805_22UF_16V_10%_X5R; Component Kind: Standard; Component Type: Standard; Pin Count: 2; Value: 22uF; Status: Preferred; Manufacturer Part Number: CC0805_22UF_16V_10%_X5R; Case: 0805; Mounted: Yes; Socket: No; SMD: Yes; Sense: No; Manufacturer1 Example: TDK; Manufacturer1 ComponentHeight: 1.35mm; HelpURL: \\cern.ch\dfs\Applications\Altium\Datasheets\CC0805_X5R_TDK_C.pdf; Author: CERN DEM JLC; CreateDate: 25/10/2012; LatestRevisionDate: 25/10/2012
D1 = SMBJ12A: Zener Diode; Part Description: Uni-Directional Transient Voltage Suppressor Diode; Manufacturer: FAIRCHILD SEMICONDUCTOR; Voltage: 12V; Power: 600W; PressFit: No; Bonding: No; Part Number: SMBJ12A; Component Kind: Standard; Component Type: Standard; Device: SMBJ12A; PackageDescription: DO-214-AA/SMB Diode, Molded Body; 5.34mm L X 3.625mm W X 2.65mm H, IPC Medium Density; Manufacturer Part Number: SMBJ12A; Pin Count: 2; Case: DO-214AA; Mounted: Yes; Socket: No; SMD: Yes; Sense: No; ComponentHeight: 2.65mm; HelpURL: \\cern.ch\dfs\Applications\Altium\Datasheets\SMBJ.pdf; Author: CERN DEM JLC; CreateDate: 10.04.2013; LatestRevisionDate: 10.04.2013
FL1 = FIL_MURATA_BNX022-01L: Block Type EMIFIL (LC Combined); Part Description: Block Type EMIFIL (LC Combined) SMD Type, BNX02* Series; Manufacturer: MURATA; Resistance: 0.5R; Part Number: FIL_MURATA_BNX022-01L; Component Kind: Standard; Component Type: Standard; Pin Count: 2; Value: 10A/50VDC; Status: None; Manufacturer Part Number: BNX022-01L; Mounted: Yes; Socket: No; SMD: Yes; Sense: No; ComponentHeight: 3.3mm; HelpURL: \\cern.ch\dfs\Applications\Altium\Datasheets\FIL_MURATA_BNX022-01L.pdf; Author: CERN DEM JLC; CreateDate: 10.10.2012; LatestRevisionDate: 10.10.2012
IC1 = TLV62130RGTT: 4-17V 3A Step-Down Converter with DCS-Control; Part Description: 4-17V to 0.9-5V, Iout (max), 3A Step-Down Converter with DCS-Control; Manufacturer: TEXAS INSTRUMENTS; PressFit: No; Bonding: No; Part Number: TLV62130RGTT; Component Kind: Standard; Component Type: Standard; Device: TLV62130RGTT; PackageDescription: QFN, 0.50mm Pitch, Square; 4 Pin X 4 Pin, 3mm X 3mm X 1.00mm H Body (w/thermal tab 1.80 X 1.80mm),  IPC Medium Density; Manufacturer Part Number: TLV62130RGTT; Pin Count: 17; Case: QFN16; Mounted: Yes; Socket: No; SMD: Yes; Sense: No; ComponentHeight: 1.0mm; HelpURL: \\cern.ch\dfs\Applications\Altium\Datasheets\TLV62130RGTT.pdf; Author: CERN DEM JLC; CreateDate: 20.01.2015; LatestRevisionDate: 20.01.2015
J9 = SWITCHCRAFT_712RA: 2.5 mm Center Pin, 5A, 48V, Right Angle, Through Hole, , DC Power Jack Connector; Part Description: 2.5 mm Center Pin, 5A, 48VDC, Right Angle, Through Hole, Locking Power Jack Connector (Threaded Bushings); Manufacturer Part Number: 712RA; PressFit: No; Part Number: SWITCHCRAFT_712RA; Component Kind: Standard; Component Type: Standard; Pin Count: 3; Family: Jack; Mounted: Yes; Socket: No; SMD: No; Sense: No; Status: None; Manufacturer: SWITCHCRAFT; ComponentHeight: 13.8mm; HelpURL: \\cern.ch\dfs\Applications\Altium\Datasheets\SWITCHCRAFT_712RA.pdf; Author: CERN DEM JLC; CreateDate: 2017-12-19; LatestRevisionDate: 2017-12-19
L1 = IND_2.2UH_20%_BOURNS_SRP6540: Inductor; Part Description: Shielded SMD Power Inductor; Manufacturer: BOURNS; Manufacturer Part Number: SRP6540-2R2M; Power: 9A; Resistance: 0.0155R; Tolerance: ±20%; Part Number: IND_2.2UH_20%_BOURNS_SRP6540; Component Kind: Standard; Component Type: Standard; Pin Count: 2; Value: 2.2uH; Status: None; Mounted: Yes; Socket: No; SMD: Yes; Sense: No; ComponentHeight: 4mm; HelpURL: \\cern.ch\dfs\Applications\Altium\Datasheets\IND_BOURNS_SRP6540.pdf; Author: CERN DEM JMW; CreateDate: 8/6/2015; LatestRevisionDate: 8/6/2015
LD1 LD2 = LED_AVAGO_HSME-C120: LED Green 1C 2A; Part Description: High Performance Right Angle Chip Green LED; Manufacturer: AVAGO TECHNOLOGIES; PressFit: No; Bonding: No; Part Number: LED_AVAGO_HSME-C120; Component Kind: Standard; Component Type: Standard; Color: Green; PackageDescription: Green Chip LED, 2-Leads, Body 1.7x1.1mm, Side Emitting Package; Manufacturer Part Number: HSME-C120; Pin Count: 2; Mounted: Yes; Socket: No; SMD: Yes; Sense: No; ComponentHeight: 0.7mm; HelpURL: \\cern.ch\dfs\Applications\Altium\Datasheets\LED_AVAGO_HSME-C120.pdf; ComponentLink1URL: \\cern.ch\dfs\Applications\Altium\Datasheets\LED_AVAGO_HSME-C110_DESIGN-GUIDE.pdf; ComponentLink1Description: Design Guide; Author: CERN DEM JMW; CreateDate: 22.07.2009; LatestRevisionDate: 20.06.2012
R13 R18 = R0603_0R_JUMPER: as R2 on sheet WR_Cute_Carrier_TOP; Part Number: R0603_0R_JUMPER; Component Kind: Standard; Component Type: Standard; Pin Count: 2; Value: 0; Status: Preferred; Manufacturer Part Number: R0603_0R_JUMPER; Case: 0603; Mounted: Yes; Sense: No; Socket: No; SMD: Yes; Manufacturer1 Example: NIC COMPONENT; Manufacturer1 ComponentHeight: 0.55mm; HelpURL: \\cern.ch\dfs\Applications\Altium\Datasheets\R0603_NIC_NRC.pdf; Author: CERN DEM JLC; CreateDate: 03.12.2007; LatestRevisionDate: 13.03.2008
R14 R17 R65 = R0402_10K_1%_0.0625W_100PPM: Resistor - 1%; Part Description: General Purpose Thick Film Chip Resistor; Manufacturer: GENERIC; Manufacturer1 Part Number: 232270671003L; TC: ±100ppm/°C; PressFit: No; Part Number: R0402_10K_1%_0.0625W_100PPM; Component Kind: Standard; Component Type: Standard; Pin Count: 2; Value: 10k; Status: Not Recommended; Power: 0.0625W; Tolerance: ±1%; Manufacturer Part Number: R0402_10K_1%_0.0625W_100PPM; Case: 0402; Mounted: Yes; Sense: No; Socket: No; SMD: Yes; Manufacturer1 Example: YAGEO PHYCOMP; Manufacturer1 ComponentHeight: 0.4mm; HelpURL: \\cern.ch\dfs\Applications\Altium\Datasheets\R0402_Phycomp_RC0402.pdf; Author: CERN DEM JLC; CreateDate: 03.12.2007; LatestRevisionDate: 17.10.2012
R15 = R0805_75K_1%_0.125W_100PPM: Resistor - 1%; Part Description: General Purpose Thick Film Chip Resistor; Manufacturer: GENERIC; Manufacturer1 Part Number: NRC10F7502TRF; Power: 0.125W; TC: ±100ppm/°C; PressFit: No; Part Number: R0805_75K_1%_0.125W_100PPM; Component Kind: Standard; Component Type: Standard; Pin Count: 2; Value: 75k; Status: Preferred; Tolerance: ±1%; Manufacturer Part Number: R0805_75K_1%_0.125W_100PPM; Case: 0805; Mounted: Yes; Sense: No; Socket: No; SMD: Yes; Manufacturer1 Example: NIC COMPONENT; Manufacturer1 ComponentHeight: 0.6mm; HelpURL: \\cern.ch\dfs\Applications\Altium\Datasheets\R0805_NIC_NRC.pdf; Author: CERN DEM JLC; CreateDate: 03/12/2007; LatestRevisionDate: 13/03/2008
R16 = R0402_1K_1%_0.0625W_100PPM: Resistor - 1%; Part Description: General Purpose Thick Film Chip Resistor; Manufacturer: GENERIC; Manufacturer1 Part Number: 232270671002L; TC: ±100ppm/°C; PressFit: No; Part Number: R0402_1K_1%_0.0625W_100PPM; Component Kind: Standard; Component Type: Standard; Pin Count: 2; Value: 1k; Status: Not Recommended; Power: 0.0625W; Tolerance: ±1%; Manufacturer Part Number: R0402_1K_1%_0.0625W_100PPM; Case: 0402; Mounted: Yes; Sense: No; Socket: No; SMD: Yes; Manufacturer1 Example: YAGEO PHYCOMP; Manufacturer1 ComponentHeight: 0.4mm; HelpURL: \\cern.ch\dfs\Applications\Altium\Datasheets\R0402_Phycomp_RC0402.pdf; Author: CERN DEM JLC; CreateDate: 03.12.2007; LatestRevisionDate: 17.10.2012
R19 = R0603_24K_1%_0.1W_100PPM: Resistor - 1%; Part Description: General Purpose Thick Film Chip Resistor; Manufacturer: GENERIC; Manufacturer1 Part Number: NRC06F2402TRF; Power: 0.1W; TC: ±100ppm/°C; PressFit: No; Part Number: R0603_24K_1%_0.1W_100PPM; Component Kind: Standard; Component Type: Standard; Pin Count: 2; Value: 24k; Status: Preferred; Tolerance: ±1%; Manufacturer Part Number: R0603_24K_1%_0.1W_100PPM; Case: 0603; Mounted: Yes; Sense: No; Socket: No; SMD: Yes; Manufacturer1 Example: NIC COMPONENT; Manufacturer1 ComponentHeight: 0.55mm; HelpURL: \\cern.ch\dfs\Applications\Altium\Datasheets\R0603_NIC_NRC.pdf; Author: CERN DEM JLC; CreateDate: 03/12/2007; LatestRevisionDate: 13/03/2008
TP12 = SMD_PAD_1.27X1.27MM: Test Point; Part Description: 1.27mm x 1.27mm PCB Copper Area (SMD Test Point); Mounted: No; Part Number: SMD_PAD_1.27X1.27MM; Component Type: Standard (No BOM); Pin Count: 1; Family: Test Point; Socket: No; SMD: Yes; Sense: No; Status: None; ComponentHeight: 0mm; HelpURL: Undefined; Author: CERN DEM JLC; CreateDate: 12.01.2008; LatestRevisionDate: 12.01.2008; PackageDescription: 1.27mm x 1.27mm PCB Copper Area (SMD Test Point)

## Sheet SFP.SchDoc: WR_Cute_Carrier
size A4; Author: F.Świtakowski; CompanyName: WUT ISE; DrawnBy: F.Świtakowski; Organization: WUT ISE; Address1: PW ISE; Address2: Nowowiejska 15/19 00-665 Warsaw; Address3: switakowski.filip@gmail.com; DocumentNumber: 4; Revision: 2; SheetNumber: 4; SheetTotal: 7; ModifiedBy: -; CheckedDate: -; Title2: SFP; DivGrp: WUT ISE; Designer: G.Kasprowicz; ModifiedDate: -; ProjectName: Sensor Box
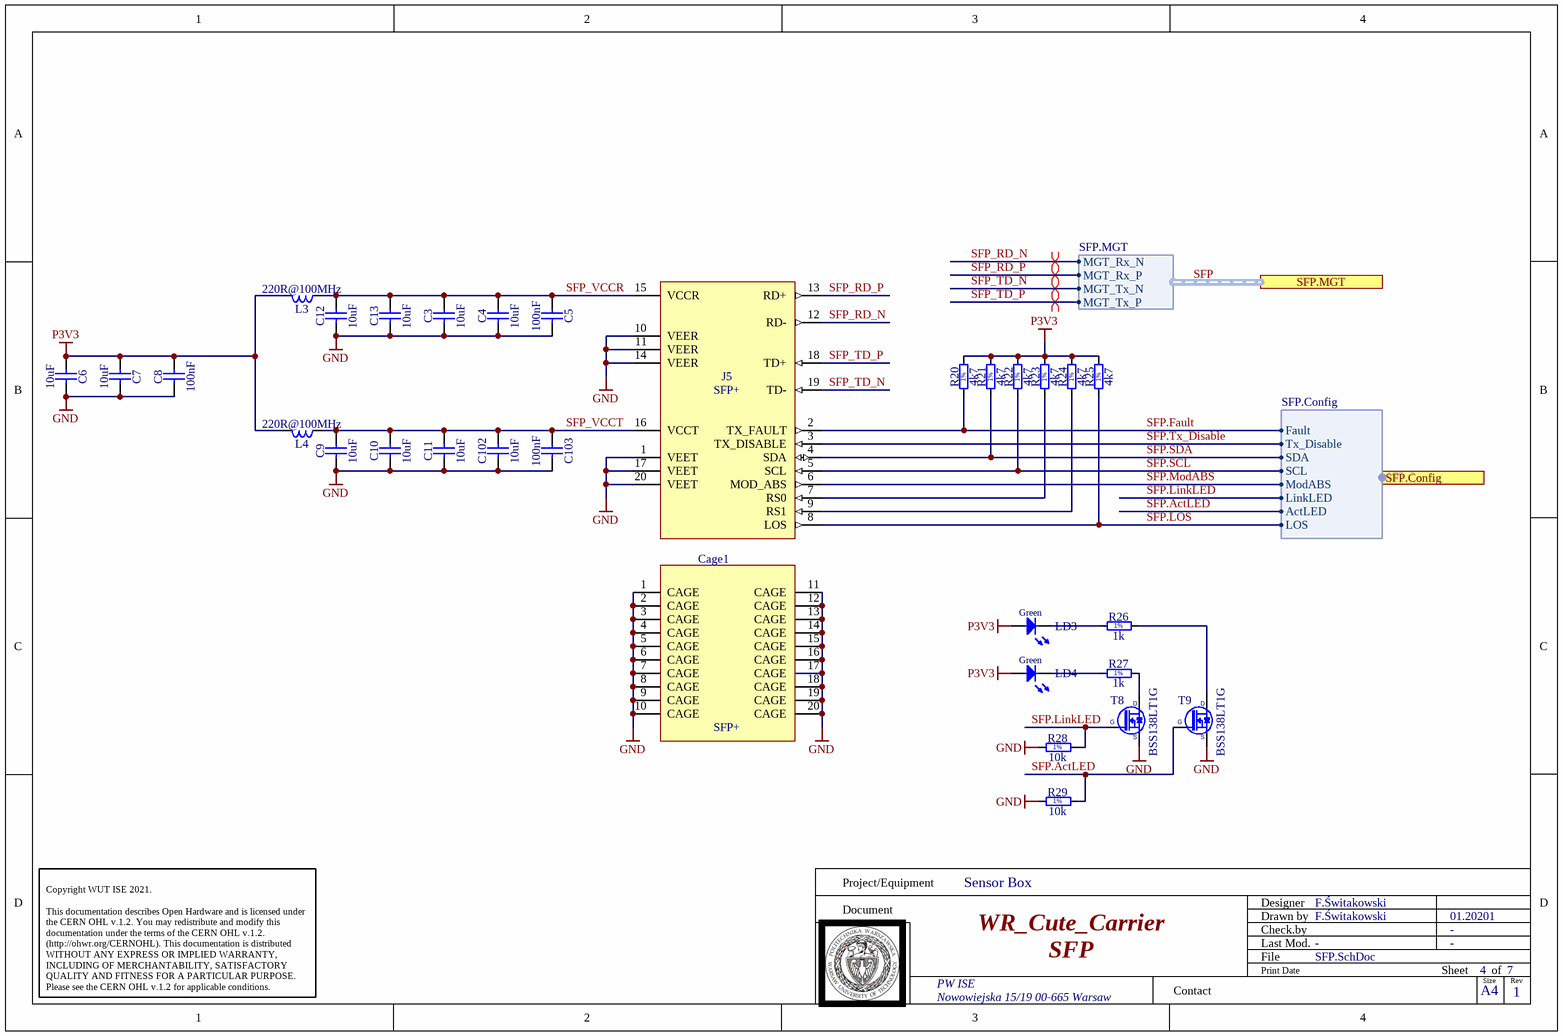
[diagram p3: SFP.SchDoc]

### Parts
C3  10uF  [CAPC1005X70N]
C4  10uF  [CAPC1005X70N]
C5  100nF  [CAPC1005X55N]
C6  10uF  [CAPC1005X70N]
C7  10uF  [CAPC1005X70N]
C8  100nF  [CAPC1005X55N]
C9  10uF  [CAPC1005X70N]
C10  10uF  [CAPC1005X70N]
C11  10uF  [CAPC1005X70N]
C12  10uF  [CAPC1005X70N]
C13  10uF  [CAPC1005X70N]
C102  10uF  [CAPC1005X70N]
C103  100nF  [CAPC1005X55N]
Cage1  SFP+  [TYCO_2007198-1]
J5  SFP+  [TYCO_1888247-1]
L3  220R@100MHz  [INDC2012X105N]
L4  220R@100MHz  [INDC2012X105N]
LD3  Green  [LED_AVAGO_HSME-C120]  (value not drawn)
LD4  Green  [LED_AVAGO_HSME-C120]  (value not drawn)
R20  4k7  [RESC1005X40N]
R21  4k7  [RESC1005X40N]
R22  4k7  [RESC1005X40N]
R23  4k7  [RESC1005X40N]
R24  4k7  [RESC1005X40N]
R25  4k7  [RESC1005X40N]
R26  1k  [RESC1005X40N]
R27  1k  [RESC1005X40N]
R28  10k  [RESC1608X55N]
R29  10k  [RESC1608X55N]
T8  BSS138LT1G  [SOT95P240X110-3N]
T9  BSS138LT1G  [SOT95P240X110-3N]

### Ports
SFP.Config (harness SFP.Config), SFP.MGT (harness SFP.MGT)

### Harnesses
SFP.MGT: MGT_Rx_N, MGT_Rx_P, MGT_Tx_N, MGT_Tx_P
SFP.Config: Fault, Tx_Disable, SDA, SCL, ModABS, LOS, LinkLED, ActLED

### Nets
GND: C3.1 C4.1 C5.2 C6.1 C7.1 C8.2 C9.1 C10.1 C11.1 C12.1 C13.1 C102.1 C103.2 Cage1.1(CAGE) Cage1.2(CAGE) Cage1.3(CAGE) Cage1.4(CAGE) Cage1.5(CAGE) Cage1.6(CAGE) Cage1.7(CAGE) Cage1.8(CAGE) Cage1.9(CAGE) Cage1.10(CAGE) Cage1.11(CAGE) Cage1.12(CAGE) Cage1.13(CAGE) Cage1.14(CAGE) Cage1.15(CAGE) Cage1.16(CAGE) Cage1.17(CAGE) Cage1.18(CAGE) Cage1.19(CAGE) Cage1.20(CAGE) J5.1(VEET) J5.10(VEER) J5.11(VEER) J5.14(VEER) J5.17(VEET) J5.20(VEET) R28.1 R29.1 T8.2(S) T9.2(S)
P3V3: C6.2 C7.2 C8.1 L3.2 L4.2 LD3.2(A) LD4.2(A) R20.2 R21.2 R22.2 R23.2 R24.2 R25.2
SFP.ActLED: R29.2 T9.1(G) ; port SFP.Config.ActLED  [project net LA10_N]
SFP.Fault: J5.2(TX_FAULT) R20.1 ; port SFP.Config.Fault  [project net LA06_P]
SFP.LinkLED: R28.2 T8.1(G) ; port SFP.Config.LinkLED  [project net LA09_N]
SFP.LOS: J5.8(LOS) R25.1 ; port SFP.Config.LOS  [project net LA14_P]
SFP.ModABS: J5.6(MOD_ABS) ; port SFP.Config.ModABS  [project net LA10_P]
SFP.SCL: J5.5(SCL) R22.1 ; port SFP.Config.SCL  [project net LA09_P]
SFP.SDA: J5.4(SDA) R21.1 ; port SFP.Config.SDA  [project net LA06_N]
SFP.Tx_Disable: J5.3(TX_DISABLE) ; port SFP.Config.Tx_Disable  [project net LA05_P]
SFP_RD_N: J5.12(RD-) ; port SFP.MGT.MGT_Rx_N  [project net DP0_C2M_N]
SFP_RD_P: J5.13(RD+) ; port SFP.MGT.MGT_Rx_P  [project net DP0_C2M_P]
SFP_TD_N: J5.19(TD-) ; port SFP.MGT.MGT_Tx_N  [project net DP0_M2C_N]
SFP_TD_P: J5.18(TD+) ; port SFP.MGT.MGT_Tx_P  [project net DP0_M2C_P]
SFP_VCCR: C3.2 C4.2 C5.1 C12.2 C13.2 J5.15(VCCR) L3.1
SFP_VCCT: C9.2 C10.2 C11.2 C102.2 C103.1 J5.16(VCCT) L4.1
NetJ5_7: J5.7(RS0) R23.1
NetJ5_9: J5.9(RS1) R24.1
NetLD3_1: LD3.1(C) R26.1
NetLD4_1: LD4.1(C) R27.1
NetR26_2: R26.2 T9.3(D)
NetR27_2: R27.2 T8.3(D)

### Buses and harness runs
harness SFP = port SFP.MGT

### Layout directives
differential pair: DP0_C2M_N, DP0_C2M_P, DP0_M2C_N, DP0_M2C_P

### Notes on the sheet
- Project/Equipment
- Document
- Designer
- Drawn by
- Check.by
- F.Świtakowski
- 01.20201
- PW ISE
- Contact
- File
- Last Mod.
- Print Date
- Sheet
- Size
- A4
- of
- 1
- Rev
- Copyright WUT ISE 2021.
  This documentation describes Open Hardware and is licensed under the CERN OHL v.1.2. You may redistribute and modify this documentation under the terms of the CERN OHL v.1.2. (http://ohwr.org/CERNOHL). This documentation is distributed WITHOUT ANY EXPRESS OR IMPLIED WARRANTY, INCLUDING OF MERCHANTABILITY, SATISFACTORY QUALITY AND FITNESS FOR A PARTICULAR PURPOSE. Please see the CERN OHL v.1.2 for applicable conditions.
- Nowowiejska 15/19 00-665 Warsaw
- (in symbol R0402_1K_1%_0.0625W_100PPM) 1%
- (in symbol R0402_4K7_1%_0.0625W_100PPM) 1%
- (in symbol R0603_10K_1%_0.1W_100PPM) 1%

### Library data of the parts
C3 C4 C6 C7 C9-C13 C102 = CC0402_10UF_6.3V_20%_X5R: Non-polarised capacitor; Part Description: SMD Multilayer Chip Ceramic Capacitor; Manufacturer: GENERIC; Manufacturer1 Part Number: C1005X5R0J106M050BC; Voltage: 6.3V; TC: X5R; Tolerance: ±10%; Part Number: CC0402_10UF_6.3V_20%_X5R; Component Kind: Standard; Component Type: Standard; Pin Count: 2; Value: 10uF; Status: Preferred; Manufacturer Part Number: CC0402_10UF_6.3V_20%_X5R; Case: 0402; Mounted: Yes; Socket: No; SMD: Yes; Manufacturer1 Example: TDK; Manufacturer1 ComponentHeight: 0.70mm; HelpURL: \\cern.ch\dfs\Applications\Altium\Datasheets\CC0402_X5R_TDK_C.pdf; Author: CERN DEM JLC; CreateDate: 07.01.2015; LatestRevisionDate: 07.01.2015; Sense: No
C5 C8 C103 = CC0402_100NF_25V_10%_X7R_YUDEN_TMK105B7104KVHF: Non-polarised capacitor; Part Description: SMD Multilayer Chip Ceramic Capacitor (High Dielectric Type) for Automotive / Industrial Applications; Manufacturer: TAIYO YUDEN; Voltage: 25V; TC: X7R; Tolerance: ±10%; Part Number: CC0402_100NF_25V_10%_X7R_YUDEN_TMK105B7104KVHF; Component Kind: Standard; Component Type: Standard; Pin Count: 2; Value: 100nF; Status: Not Recommended; Manufacturer Part Number: TMK105B7104KVHF; Case: 0402; Mounted: Yes; Socket: No; SMD: Yes; HelpURL: \\cern.ch\dfs\Applications\Altium\Datasheets\CC0402_TAIYO-YUDEN_TMK105B7104KVHF.pdf; Author: CERN DEM JLC; CreateDate: 10-May-17; LatestRevisionDate: 10-May-17; Sense: No; ComponentHeight: 0.55mm
Cage1 = TYCO_2007198-1: SFP+ 1x1 Cage (20Pins); Part Description: 1x1 Press Fit Cage For Use with SFP+ Connector (Small Form-factor Pluggable); Manufacturer: TYCO ELECTRONICS; Part Number: TYCO_2007198-1; Component Kind: Standard; Component Type: Standard; Pin Count: 20; Family: SFP+; Mounted: Yes; Socket: No; SMD: No; PressFit: Yes; Status: None; Manufacturer Part Number: 2007198-1; ComponentHeight: 9.7mm; HelpURL: \\cern.ch\dfs\Applications\Altium\Datasheets\TYCO_2007198-1.pdf; Author: CERN DEM JLC; CreateDate: 04-Jun-13; LatestRevisionDate: 12-Jun-13; Sense: No
J5 = TYCO_1888247-1: 20 Position SFP+ Connector (Small Form-factor Pluggable); Part Description: 20 Position, Pitch 0.8mm SFP+ Receptacle (Small Form-factor Pluggable); Manufacturer: TYCO ELECTRONICS; PressFit: No; Part Number: TYCO_1888247-1; Component Kind: Standard; Component Type: Standard; Pin Count: 20; Family: SFP+; Mounted: Yes; Socket: No; SMD: Yes; Status: None; Manufacturer Part Number: 1888247-1; ComponentHeight: 5.4mm; HelpURL: \\cern.ch\dfs\Applications\Altium\Datasheets\TYCO_1888247-1.pdf; Author: CERN DEM JLC; CreateDate: 27-Feb-12; LatestRevisionDate: 27-Feb-12; Sense: No
L3 L4 = IND0805_MURATA_BLM21PG221SN1D: Inductor; Part Description: SMD EMIFIL Suppression Chip Ferrite Bead; Manufacturer: MURATA; Power: 2A; Resistance: 0.05R; Tolerance: ±25%; Part Number: IND0805_MURATA_BLM21PG221SN1D; Component Kind: Standard; Component Type: Standard; Pin Count: 2; Value: 220R@100MHz; Status: None; Manufacturer Part Number: BLM21PG221SN1D; Case: 0805; Mounted: Yes; Socket: No; SMD: Yes; Sense: No; ComponentHeight: 1.05mm; HelpURL: \\cern.ch\dfs\Applications\Altium\Datasheets\IND0805_MURATA_BLM21P.pdf; Author: CERN DEM JLC; CreateDate: 25/01/2010; LatestRevisionDate: 25/01/2010
LD3 LD4 = LED_AVAGO_HSME-C120: as LD1 on sheet PWR; Part Number: LED_AVAGO_HSME-C120; Component Kind: Standard; Component Type: Standard; Color: Green; PackageDescription: Green Chip LED, 2-Leads, Body 1.7x1.1mm, Side Emitting Package; Manufacturer Part Number: HSME-C120; Pin Count: 2; Mounted: Yes; Socket: No; SMD: Yes; Sense: No; ComponentHeight: 0.7mm; HelpURL: \\cern.ch\dfs\Applications\Altium\Datasheets\LED_AVAGO_HSME-C120.pdf; ComponentLink1URL: \\cern.ch\dfs\Applications\Altium\Datasheets\LED_AVAGO_HSME-C110_DESIGN-GUIDE.pdf; ComponentLink1Description: Design Guide; Author: CERN DEM JMW; CreateDate: 22.07.2009; LatestRevisionDate: 20.06.2012
R20-R25 = R0402_4K7_1%_0.0625W_100PPM: Resistor - 1%; Part Description: General Purpose Thick Film Chip Resistor; Manufacturer: GENERIC; Manufacturer1 Part Number: 232270674702L; TC: ±100ppm/°C; PressFit: No; Part Number: R0402_4K7_1%_0.0625W_100PPM; Component Kind: Standard; Component Type: Standard; Pin Count: 2; Value: 4k7; Status: Not Recommended; Manufacturer Part Number: R0402_4K7_1%_0.0625W_100PPM; Case: 0402; Mounted: Yes; Socket: No; SMD: Yes; Manufacturer1 Example: YAGEO PHYCOMP; Manufacturer1 ComponentHeight: 0.4mm; HelpURL: \\cern.ch\dfs\Applications\Altium\Datasheets\R0402_Phycomp_RC0402.pdf; Author: CERN DEM JLC; CreateDate: 03-Dec-07; LatestRevisionDate: 17-Oct-12; Sense: No; Tolerance: ±1%; Power: 0.0625W
R26 R27 = R0402_1K_1%_0.0625W_100PPM: as R16 on sheet PWR; Part Number: R0402_1K_1%_0.0625W_100PPM; Component Kind: Standard; Component Type: Standard; Pin Count: 2; Value: 1k; Status: Not Recommended; Power: 0.0625W; Tolerance: ±1%; Manufacturer Part Number: R0402_1K_1%_0.0625W_100PPM; Case: 0402; Mounted: Yes; Sense: No; Socket: No; SMD: Yes; Manufacturer1 Example: YAGEO PHYCOMP; Manufacturer1 ComponentHeight: 0.4mm; HelpURL: \\cern.ch\dfs\Applications\Altium\Datasheets\R0402_Phycomp_RC0402.pdf; Author: CERN DEM JLC; CreateDate: 03.12.2007; LatestRevisionDate: 17.10.2012
R28 R29 = R0603_10K_1%_0.1W_100PPM: as R5 on sheet WR_Cute_Carrier_TOP; Part Number: R0603_10K_1%_0.1W_100PPM; Component Kind: Standard; Component Type: Standard; Pin Count: 2; Value: 10k; Status: Preferred; Tolerance: ±1%; Manufacturer Part Number: R0603_10K_1%_0.1W_100PPM; Case: 0603; Mounted: Yes; Sense: No; Socket: No; SMD: Yes; Manufacturer1 Example: NIC COMPONENT; Manufacturer1 ComponentHeight: 0.55mm; HelpURL: \\cern.ch\dfs\Applications\Altium\Datasheets\R0603_NIC_NRC.pdf; Author: CERN DEM JLC; CreateDate: 03.12.2007; LatestRevisionDate: 13.03.2008
T8 T9 = BSS138LT1G: N-CHANNEL MOSFET WITH DIODE; Part Description: 50V 200mA N-Channel Enhancement Mode Field-Effect Transistor; Manufacturer: ON SEMICONDUCTOR; PressFit: No; Bonding: No; Part Number: BSS138LT1G; Component Kind: Standard; Component Type: Standard; Device: BSS138LT1G; PackageDescription: SOT23 3-Leads, Pitch 0.95mm - Body 1.4x3mm, IPC Medium Density; Manufacturer Part Number: BSS138LT1G; Pin Count: 3; Case: SOT23-3; Mounted: Yes; Socket: No; SMD: Yes; Sense: No; ComponentHeight: 1.11mm; HelpURL: \\cern.ch\dfs\Applications\Altium\Datasheets\BSS138LT1G.pdf; Author: CERN DEM JLC; CreateDate: 23-Mar-09; LatestRevisionDate: 23-Mar-09